# EasyEDA schematic SCHematic_wetterstation_1_2021-12-09.json
TITLE: Wettersensor; REV: 1.0; Date: 2021-11-25; Sheet: 1/1; Drawn By: Heribert S.; Company: --
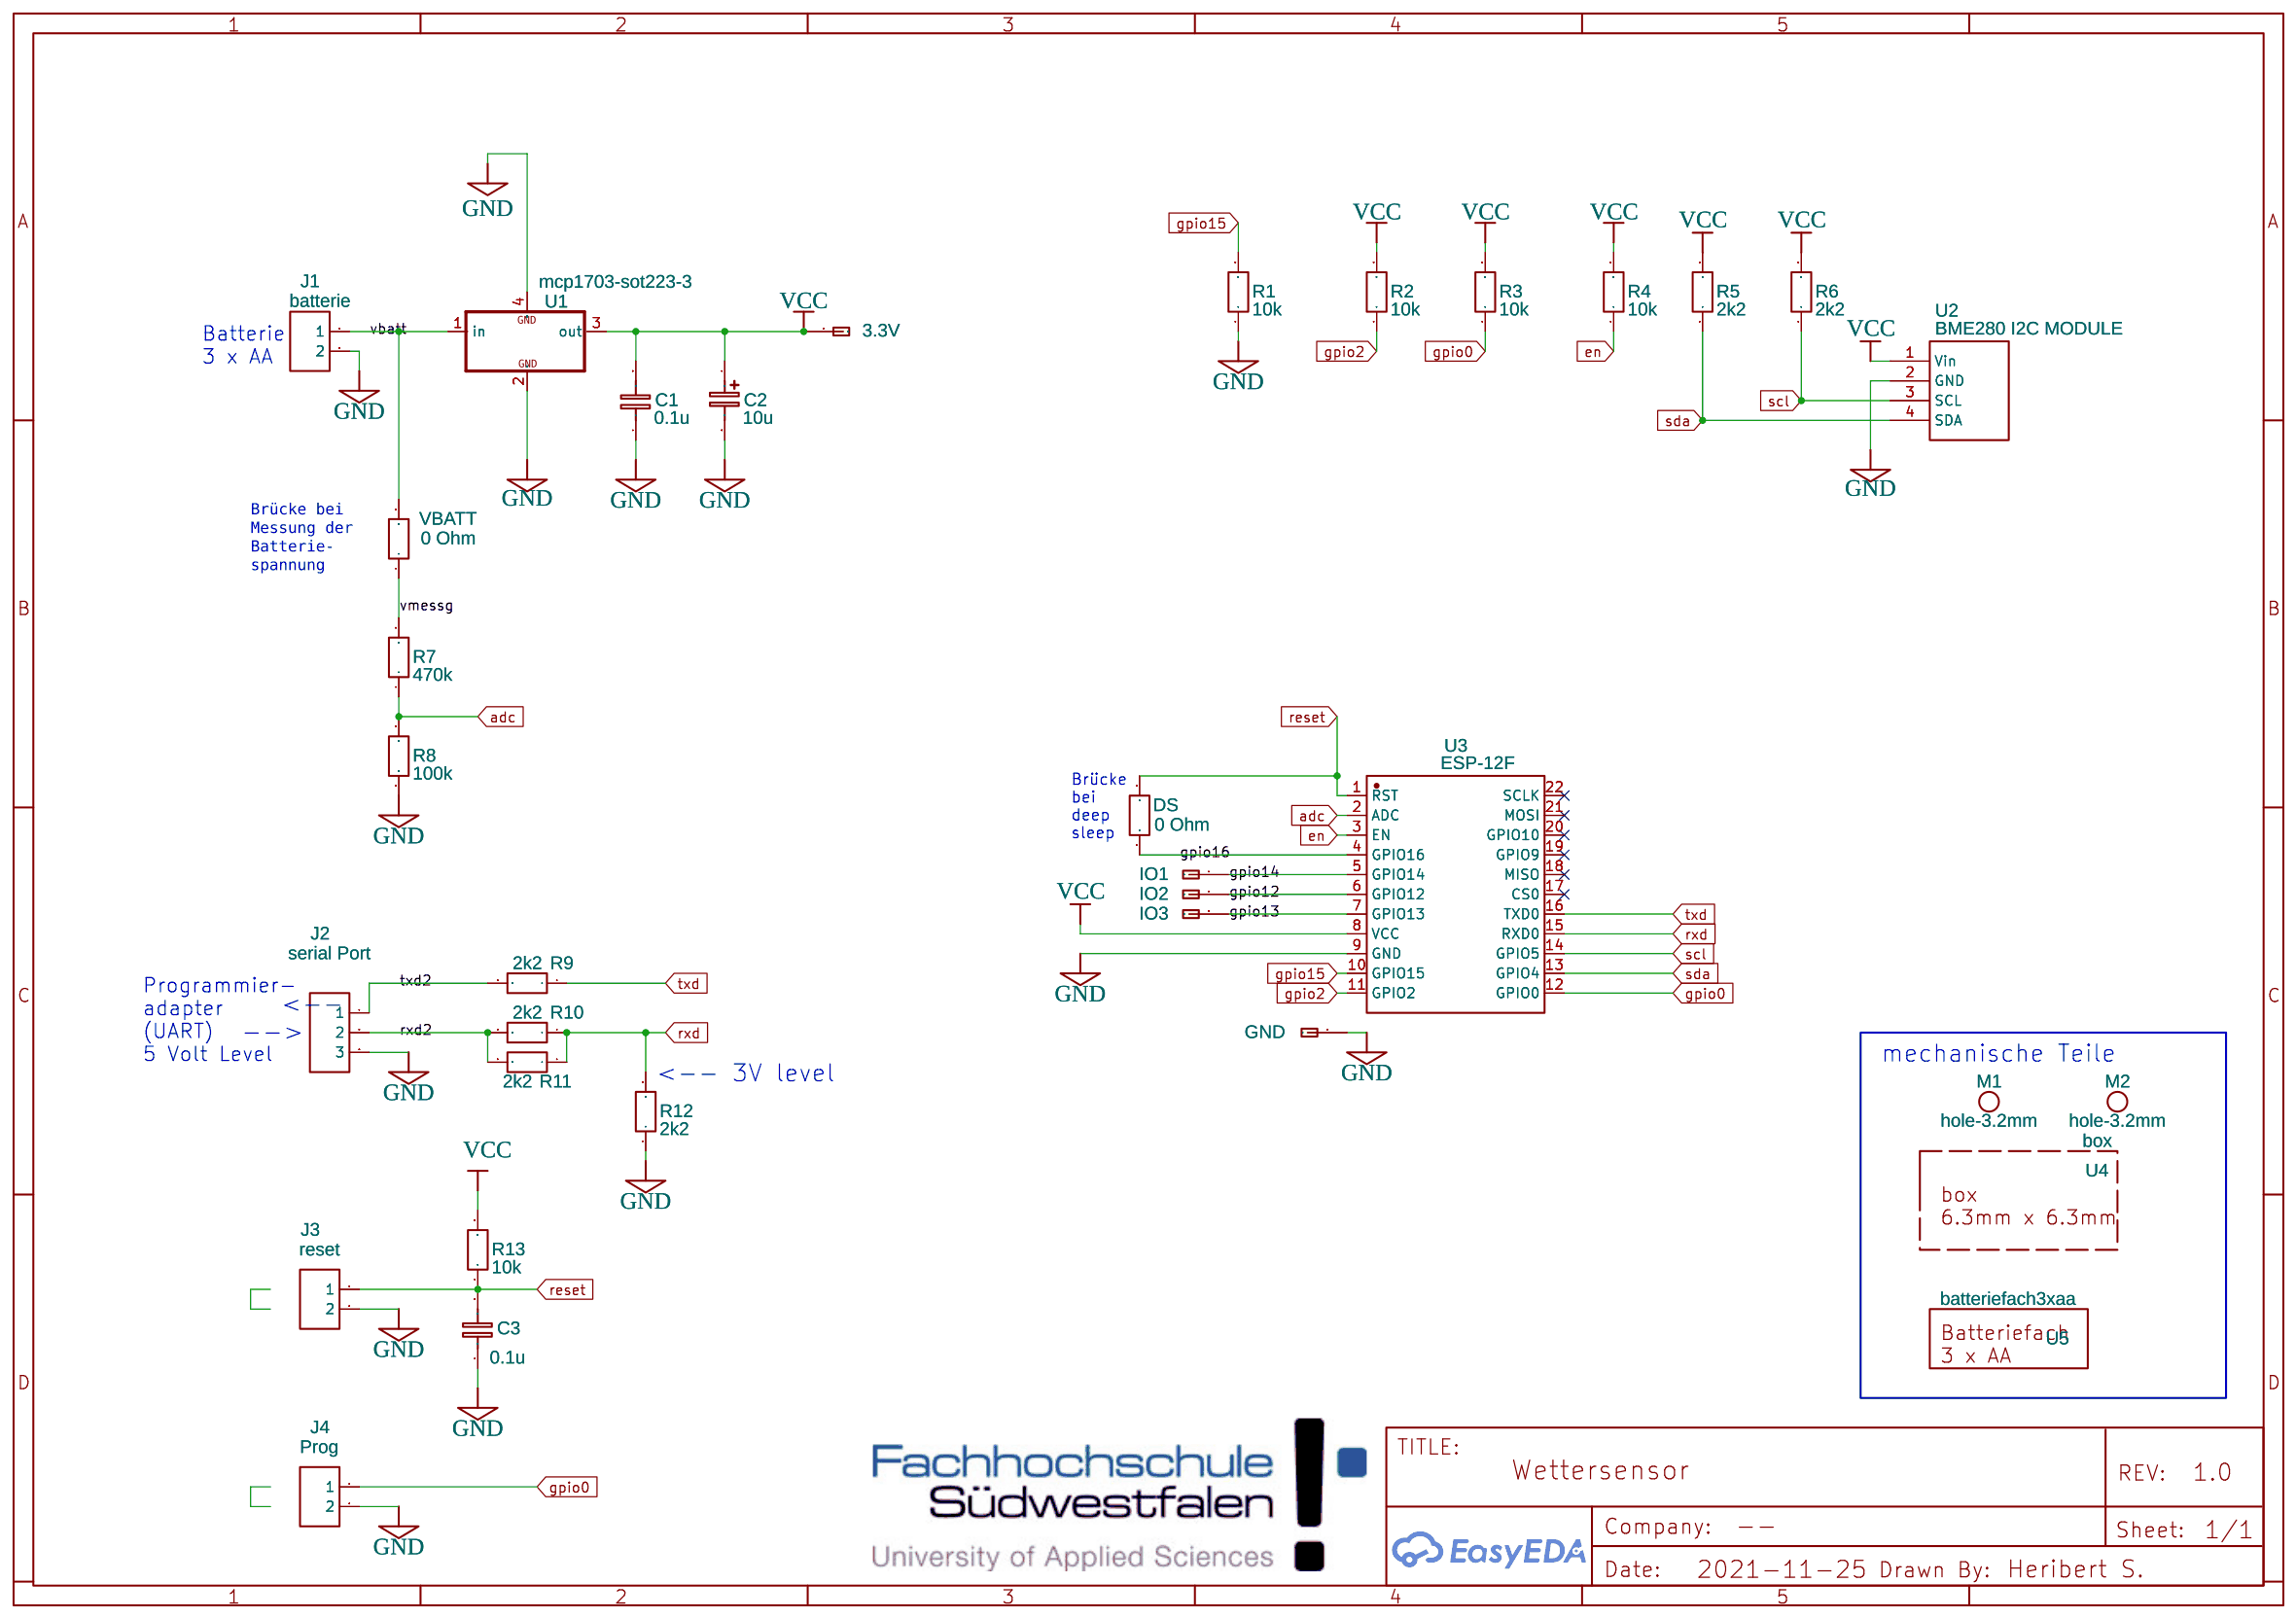
[diagram p0: schematic sheet]

## Parts
3.3V  smdPad  [SMDPAD]
C1  0.1u  [C0603]
C2  10u  [CASE-A_3216]
C3  0.1u  [C0603]
DS  0 Ohm  [R0805]
GND  smdPad  [SMDPAD]
IO1  smdPad  [SMDPAD]
IO2  smdPad  [SMDPAD]
IO3  smdPad  [SMDPAD]
J1  batterie  [HDR-M-2.54_1X2]
J2  serial Port  [HDR-M-2.54_1X3]
J3  reset  [HDR-M-2.54_1X2]
J4  Prog  [HDR-M-2.54_1X2]
M1  hole-3.2mm  [MOUNTINGHOLE_3.2MM_M3]
M2  hole-3.2mm  [MOUNTINGHOLE_3.2MM_M3]
R1  10k  [R0805]
R2  10k  [R0805]
R3  10k  [R0805]
R4  10k  [R0805]
R5  2k2  [R0805]
R6  2k2  [R0805]
R7  470k  [R0805]
R8  100k  [R0805]
R9  2k2  [R0805]
R10  2k2  [R0805]
R11  2k2  [R0805]
R12  2k2  [R0805]
R13  10k  [R0805]
U1  mcp1703-sot223-3  [SOT223-3-1]
U2  BME280 I2C MODULE  [BME280]
U3  ESP-12F  [WIFIM-SMD_ESP-12F-ESP8266MOD]
U4  box  [BOX]
U5  batteriefach3xaa  [BATTERIEFACH3XAA]
VBATT  0 Ohm  [R0805]

## Library data of the parts
3.3V GND IO1-IO3 = smdPad: Contributor: bert
C1 C3 = C_0603_EU: Contributor: LCEDA_Lib
C2 = C_Tan_SMD_A_EU: Contributor: LCEDA_Lib
DS R1-R13 VBATT = R_0805_EU: Contributor: LCEDA_Lib
J1 J3 J4 = HDR-M-2.54_1x2: Supplier Part: C124375; Supplier: LCSC; Contributor: LCEDA_Lib
J2 = HDR-M-2.54_1x3: Supplier Part: C180248; Supplier: LCSC; Contributor: LCEDA_Lib
M1 M2 = hole-3.2mm: Supplier Part: C265414; Manufacturer: JST Sales America; Manufacturer Part: SIN-002T-1.0; Contributor: bert; JLCPCB Part Class: Extended Part
U1 = mcp1703-sot223-3: Contributor: bert; Supplier Part: MCP 1703-3302; Supplier: reichelt
U2 = BME280 I2C MODULE: Contributor: Dorin Nicoara; Package Display: No
U3 = ESP-12F(ESP8266MOD): Supplier: LCSC; Manufacturer: Ai-Thinker; Supplier Part: C82891; JLCPCB Part Class: Extended Part
U4 = box: Contributor: bert
U5 = batteriefach3xaa: Contributor: bert

## Nets
GND: C1.1 C2.2 C3.1 GND.1 J1.2 J2.3 J3.2 J4.2 R1.1 R8.1 R12.1 U1.2(GND) U1.4(GND) U2.2(GND) U3.9(GND)
vbatt: J1.1 U1.1(in) VBATT.2
VCC: 3.3V.1 C1.2 C2.1 R2.2 R3.2 R4.2 R5.2 R6.2 R13.2 U1.3(out) U2.1(Vin) U3.8(VCC)
adc: R7.1 R8.2 U3.2(ADC)
en: R4.1 U3.3(EN)
gpio0: J4.1 R3.1 U3.12(GPIO0)
gpio2: R2.1 U3.11(GPIO2)
gpio12: IO2.1 U3.6(GPIO12)
gpio13: IO3.1 U3.7(GPIO13)
gpio14: IO1.1 U3.5(GPIO14)
gpio15: R1.2 U3.10(GPIO15)
gpio16: DS.1 U3.4(GPIO16)
reset: C3.2 DS.2 J3.1 R13.1 U3.1(RST)
rxd: R10.1 R11.1 R12.2 U3.15(RXD0)
rxd2: J2.2 R10.2 R11.2
scl: R6.1 U2.3(SCL) U3.14(GPIO5)
sda: R5.1 U2.4(SDA) U3.13(GPIO4)
txd: R9.1 U3.16(TXD0)
txd2: J2.1 R9.2
vmessg: R7.2 VBATT.1

Not connected (* = marked no-connect by the designer): U3 17(CS0)* 18(MISO)* 19(GPIO9)* 20(GPIO10)* 21(MOSI)* 22(SCLK)*

## Notes on the sheet
- Batterie
  3 x AA
- Brücke bei
  Messung der
  Batterie-
  spannung
- Brücke
  bei
  deep
  sleep
- Programmier-
  adapter
  (UART)
  5 Volt Level
- <--
- -->
- mechanische Teile
- <-- 3V level
